# EAGLE design LEDS (EAGLE 6.5.0)
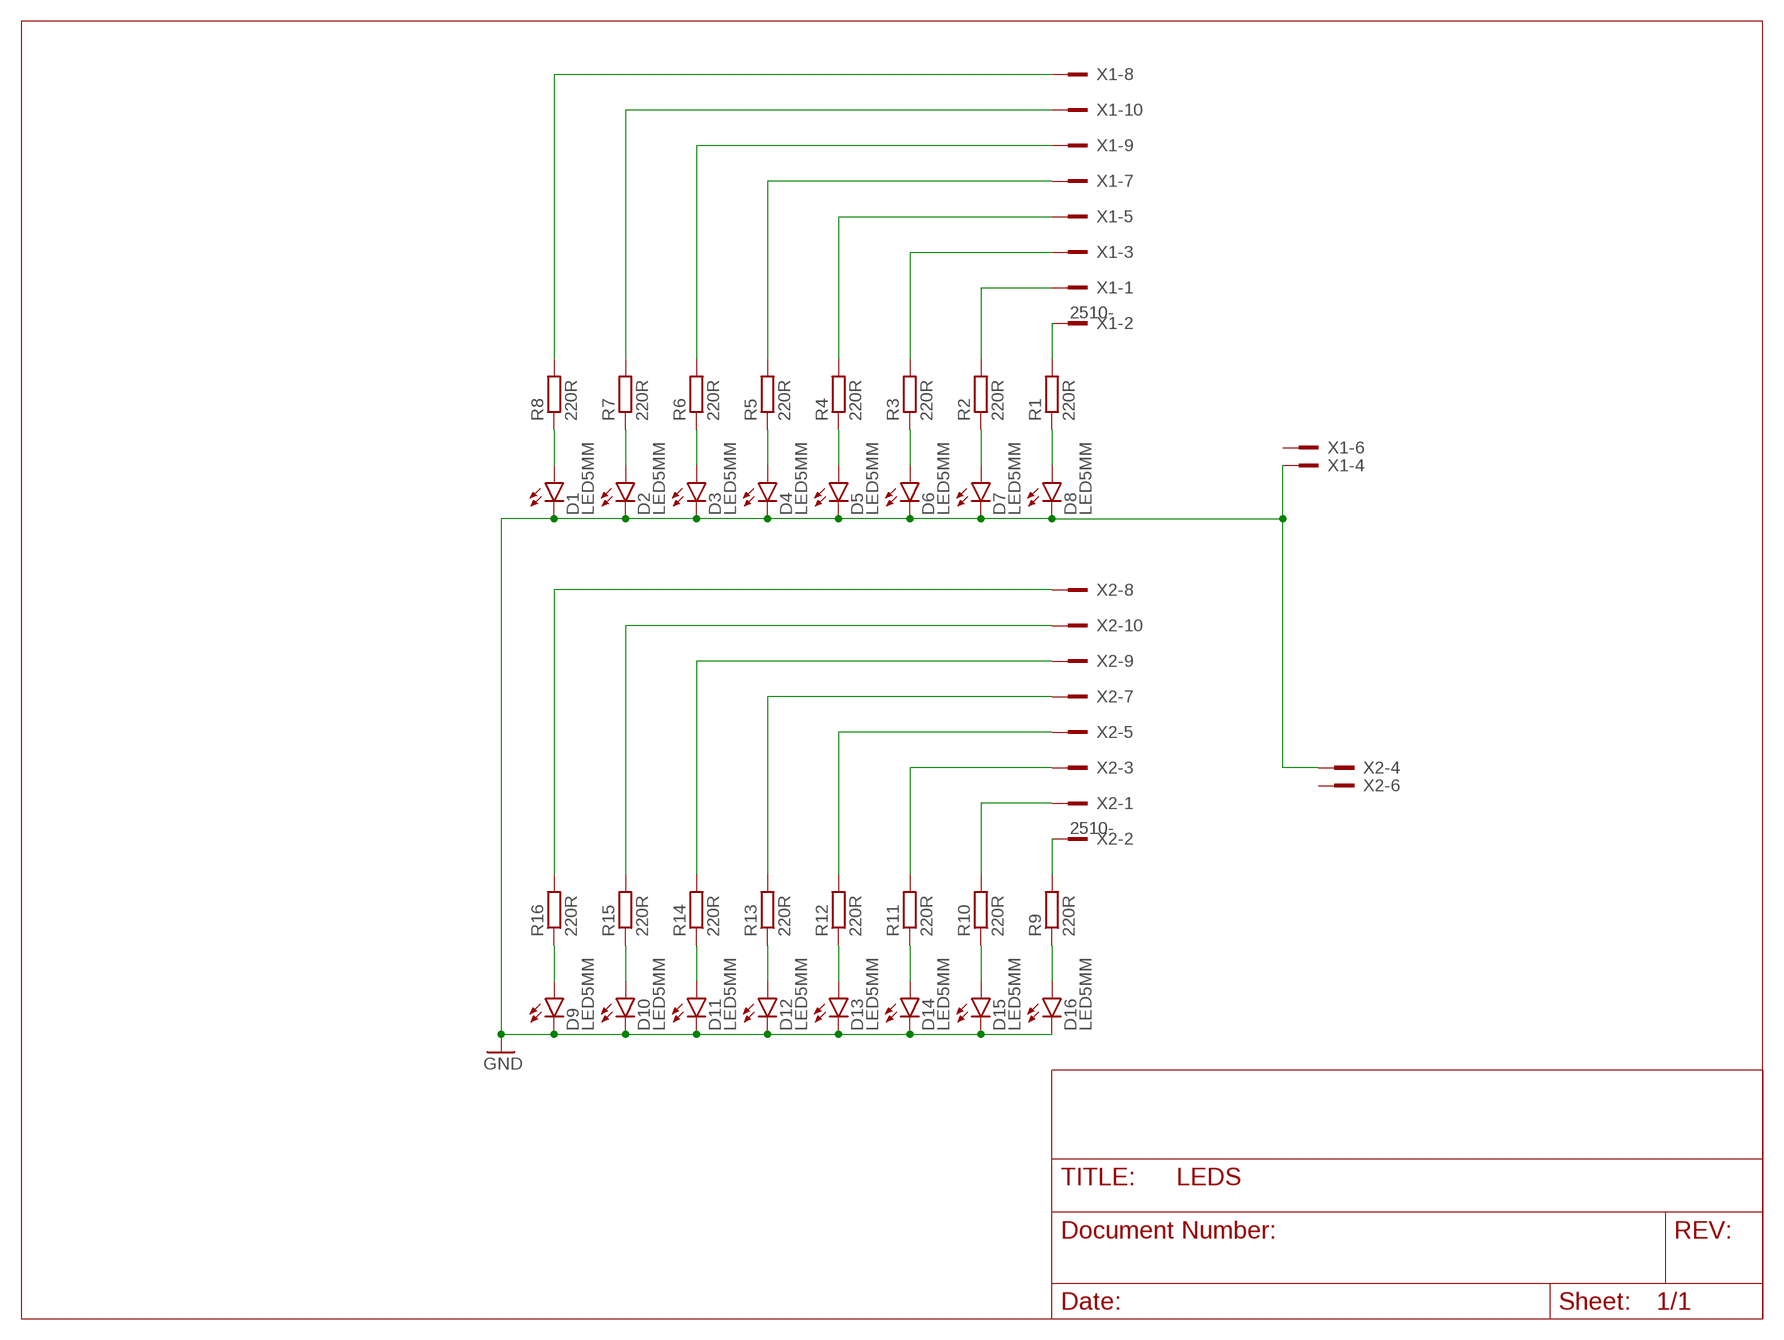
[diagram p0: schematic, sheet 1]

## Parts
D1  LED5MM  [LED5MM]
D2  LED5MM  [LED5MM]
D3  LED5MM  [LED5MM]
D4  LED5MM  [LED5MM]
D5  LED5MM  [LED5MM]
D6  LED5MM  [LED5MM]
D7  LED5MM  [LED5MM]
D8  LED5MM  [LED5MM]
D9  LED5MM  [LED5MM]
D10  LED5MM  [LED5MM]
D11  LED5MM  [LED5MM]
D12  LED5MM  [LED5MM]
D13  LED5MM  [LED5MM]
D14  LED5MM  [LED5MM]
D15  LED5MM  [LED5MM]
D16  LED5MM  [LED5MM]
R1  220R  R-EU_  [0204/ELVYS]
R2  220R  R-EU_  [0204/ELVYS]
R3  220R  R-EU_  [0204/ELVYS]
R4  220R  R-EU_  [0204/ELVYS]
R5  220R  R-EU_  [0204/ELVYS]
R6  220R  R-EU_  [0204/ELVYS]
R7  220R  R-EU_  [0204/ELVYS]
R8  220R  R-EU_  [0204/ELVYS]
R9  220R  R-EU_  [0204/ELVYS]
R10  220R  R-EU_  [0204/ELVYS]
R11  220R  R-EU_  [0204/ELVYS]
R12  220R  R-EU_  [0204/ELVYS]
R13  220R  R-EU_  [0204/ELVYS]
R14  220R  R-EU_  [0204/ELVYS]
R15  220R  R-EU_  [0204/ELVYS]
R16  220R  R-EU_  [0204/ELVYS]
X1  2510-  [PAK100/2500-10]
X2  2510-  [PAK100/2500-10]

## Nets
GND: D1.K(C) D2.K(C) D3.K(C) D4.K(C) D5.K(C) D6.K(C) D7.K(C) D8.K(C) D9.K(C) D10.K(C) D11.K(C) D12.K(C) D13.K(C) D14.K(C) D15.K(C) D16.K(C) X1.4 X2.4
N$1: R16.P$2 X2.8
N$2: R8.P$2 X1.8
N$3: R6.P$2 X1.9
N$4: R7.P$2 X1.10
N$5: R5.P$2 X1.7
N$6: R4.P$2 X1.5
N$7: R3.P$2 X1.3
N$8: R2.P$2 X1.1
N$9: R1.P$2 X1.2
N$10: R15.P$2 X2.10
N$11: R14.P$2 X2.9
N$12: R13.P$2 X2.7
N$13: R12.P$2 X2.5
N$14: R11.P$2 X2.3
N$15: R10.P$2 X2.1
N$16: R9.P$2 X2.2
N$17: D1.A R8.P$1
N$18: D2.A R7.P$1
N$19: D3.A R6.P$1
N$20: D4.A R5.P$1
N$21: D5.A R4.P$1
N$22: D6.A R3.P$1
N$23: D7.A R2.P$1
N$24: D8.A R1.P$1
N$26: D9.A R16.P$1
N$27: D10.A R15.P$1
N$28: D11.A R14.P$1
N$29: D12.A R13.P$1
N$30: D13.A R12.P$1
N$31: D14.A R11.P$1
N$32: D15.A R10.P$1
N$33: D16.A R9.P$1
Unconnected: X1.6 X2.6

## Library data of the parts
D1-D16 = gm-diodes:LED
R1-R16 = rcl:R-EU_: RESISTOR, European symbol
X1 X2 = con-3m:2510-: 3M (TM) Pak 100 4-Wall Header Source: 3M; MF: 3M; MPN: 2510-6002UB; OC_FARNELL: 9838244; OC_NEWARK: 46F4725

## Board
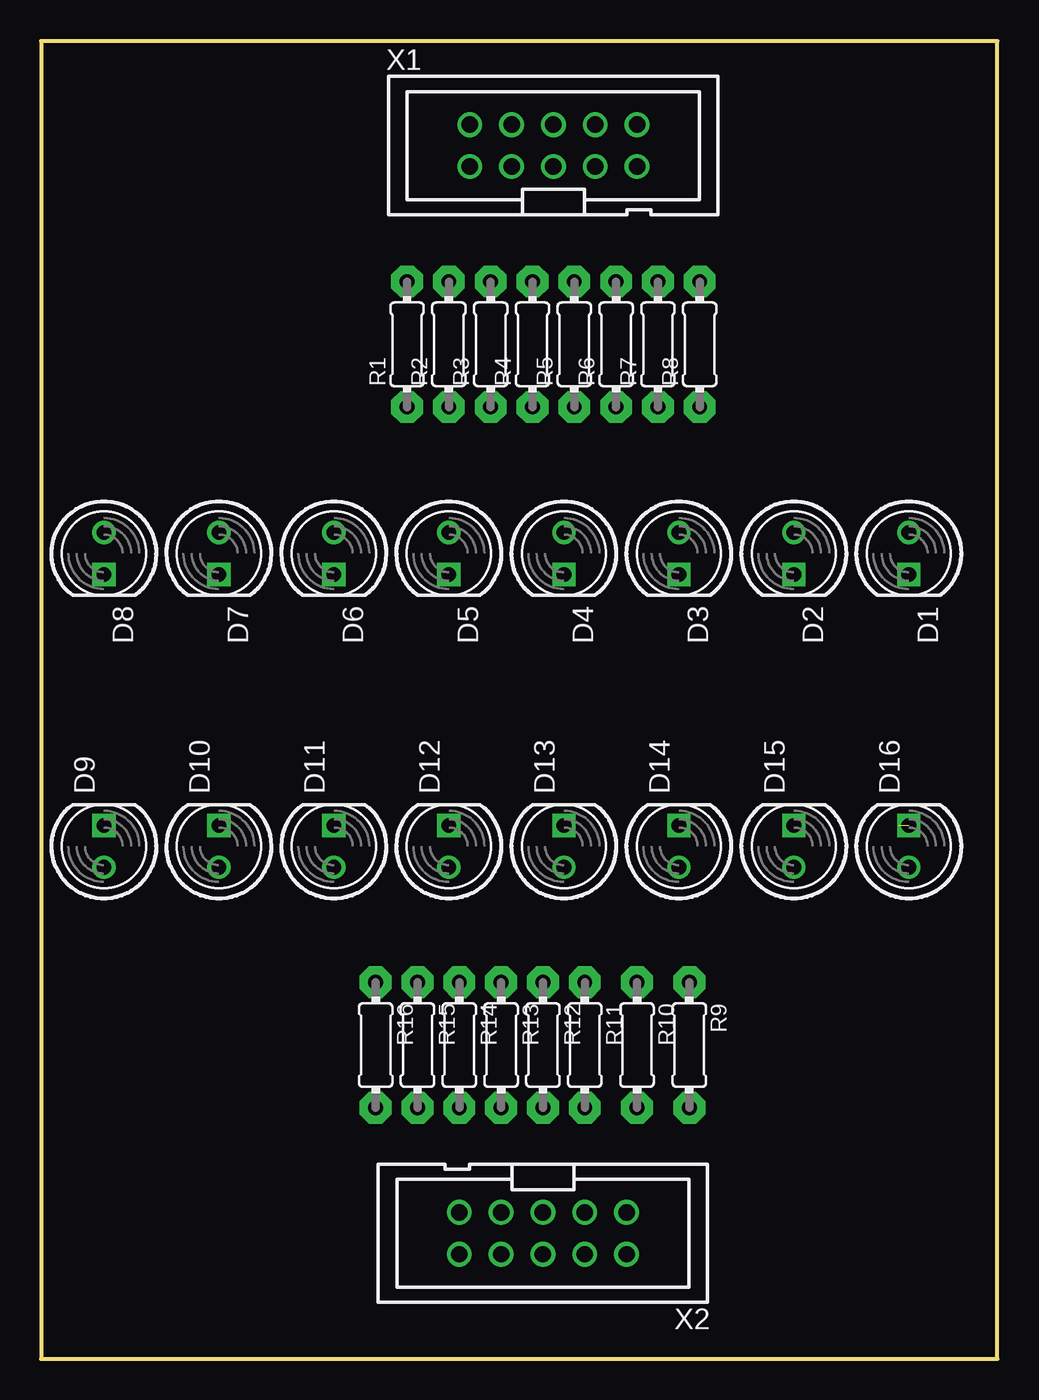
[diagram p1: board, top side]
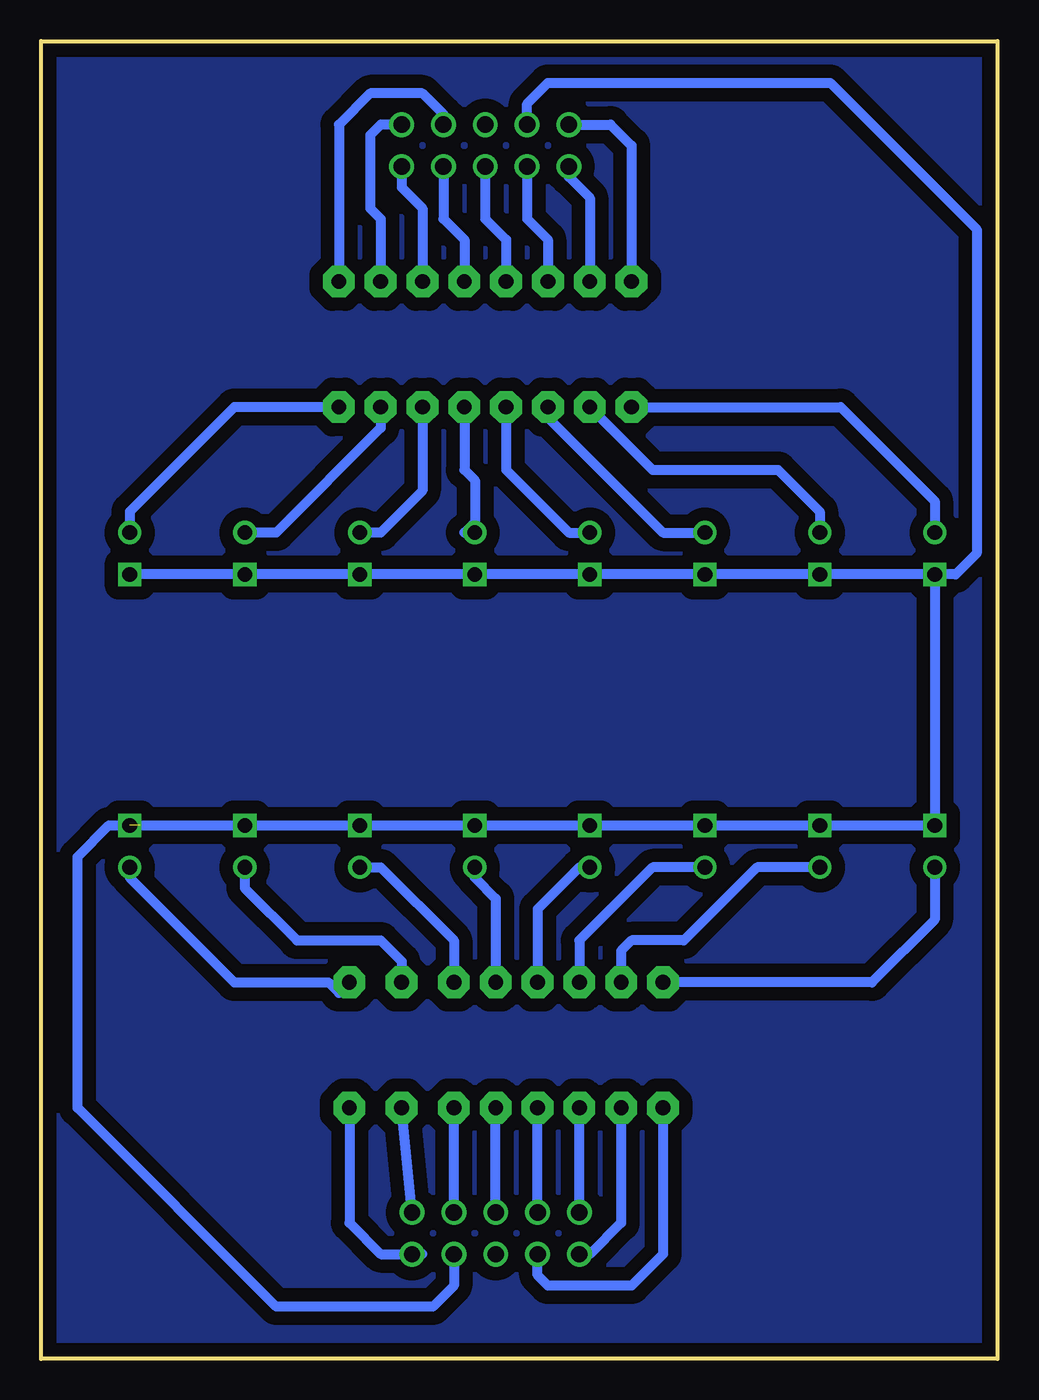
[diagram p2: board, bottom side, seen from below]

Size 58.09 x 80 mm. Coordinates in mm from the lower left corner, seen from the top.
Outline: 0,0 58.09,0 58.09,80 0,80 0,0
Copper layers (1*16): Top 0.035mm / dielectric 1.5mm / Bottom 0.035mm
Design rules "default *": minimum track width 10mil, minimum drill 24mil, track to track 12mil, track to pad 12mil, pad to pad 12mil, via to via 12mil, smd to smd 8mil, copper to edge 16mil, drill to drill 8mil, minimum pad ring 10mil, minimum via ring 8mil, stop-mask expansion 4mil, vias tented up to drill 0mil, thermal gap 10mil

### Footprints (pad centres in the part's own frame; a part is rotated, then mirrored left to right if it is on the bottom)
LED5MM = drill 0.9: A -1.27,0 | drill 0.9 square: K 1.27,0
0204/ELVYS = drill 0.9 pad 1.93 octagon: P$1 -6.35,0; P$2 1.27,0
PAK100/2500-10 = drill 1 pad 1.422: 1 -5.08,-1.27; 2 -5.08,1.27; 3 -2.54,-1.27; 4 -2.54,1.27; 5 0,-1.27; 6 0,1.27; 7 2.54,-1.27; 8 2.54,1.27; 9 5.08,-1.27; 10 5.08,1.27

### Placement (x,y rotation side)
D1  52.7,48.9 270 top
D2  45.72,48.9 270 top
D3  38.73,48.9 270 top
D4  31.75,48.9 270 top
D5  24.77,48.9 270 top
D6  17.78,48.9 270 top
D7  10.79,48.9 270 top
D8  3.81,48.9 270 top
D9  3.81,31.11 90 top
D10  10.79,31.11 90 top
D11  17.78,31.11 90 top
D12  24.77,31.11 90 top
D13  31.75,31.11 90 top
D14  38.73,31.11 90 top
D15  45.72,31.11 90 top
D16  52.7,31.11 90 top
R1  22.23,64.14 90 top
R2  24.77,64.14 90 top
R3  27.3,64.14 90 top
R4  29.84,64.14 90 top
R5  32.38,64.14 90 top
R6  34.92,64.14 90 top
R7  37.47,64.14 90 top
R8  40.01,64.14 90 top
R9  39.37,16.51 270 top
R10  36.2,16.51 270 top
R11  33.02,16.51 270 top
R12  30.48,16.51 270 top
R13  27.94,16.51 270 top
R14  25.4,16.51 270 top
R15  22.86,16.51 270 top
R16  20.32,16.51 270 top
X1  31.11,73.66 0 top
X2  30.48,7.62 180 top

### Tracks (layer width: path | path; a pad name or v marks a point on that pad's centre or on a via)
GND  (1 unrouted)
  Bottom 0.61: X1.4 28.57,76.2 27.3,77.47 10.16,77.47 1.27,68.58 1.27,48.9 2.54,47.62 D8.K | D8.K D7.K D6.K D5.K D4.K D3.K D2.K D1.K | D15.K 52.07,32.38 53.98,32.38 55.88,30.48 55.88,15.24 43.81,3.17 34.29,3.17 33.02,4.45 X2.4 | D15.K D14.K D13.K D12.K D11.K D10.K D9.K | D15.K D9.K | D8.K D9.K
N$1
  Bottom 0.61: R16.P$2 20.32,6.35 22.23,4.45 27.3,4.45 27.94,5.08 X2.8
N$2
  Bottom 0.61: X1.8 33.66,75.56 34.92,76.83 38.1,76.83 40.01,74.93 R8.P$2
N$3
  Bottom 0.61: X1.9 36.2,71.12 34.92,69.85 R6.P$2
N$4
  Bottom 0.61: X1.10 37.47,74.93 38.1,74.3 38.1,69.85 37.47,69.22 R7.P$2
N$5
  Bottom 0.61: X1.7 33.66,69.22 32.38,67.94 R5.P$2
N$6
  Bottom 0.61: X1.5 31.11,69.22 29.84,67.94 R4.P$2
N$7
  Bottom 0.61: X1.3 28.57,69.22 27.3,67.94 R3.P$2
N$8
  Bottom 0.61: X1.1 26.04,71.75 24.77,70.48 R2.P$2
N$9
  Bottom 0.61: X1.2 23.5,74.93 22.23,73.66 R1.P$2
N$10
  Bottom 0.61: R15.P$2 22.86,8.26 24.77,6.35 X2.10
N$11
  Bottom 0.61: X2.9 R14.P$2
N$12
  Bottom 0.61: X2.7 R13.P$2
N$13
  Bottom 0.61: X2.5 R12.P$2
N$14
  Bottom 0.61: X2.3 R11.P$2
N$15
  Bottom 0.61: X2.1 R10.P$2
N$16
  Bottom 0.61: 34.92,6.35 X2.2 37.47,6.35 39.37,8.26 R9.P$2
N$17
  Bottom 0.61: R8.P$1 46.35,57.78 52.7,51.44 D1.A
N$18
  Bottom 0.61: R7.P$1 37.47,56.52 43.81,50.16 D2.A
N$19
  Bottom 0.61: R6.P$1 34.92,52.7 37.47,50.16 D3.A
N$20
  Bottom 0.61: R5.P$1 32.38,53.98 31.75,53.34 31.75,50.8 32.38,50.16 D4.A
N$21
  Bottom 0.61: R4.P$1 29.84,53.98 26.04,50.16 D5.A
N$22
  Bottom 0.61: R3.P$1 27.3,57.15 20.32,50.16 D6.A
N$23
  Bottom 0.61: R2.P$1 20.95,53.98 13.34,53.98 10.79,51.44 D7.A
N$24
  Bottom 0.61: R1.P$1 9.53,57.78 3.81,52.07 D8.A
N$25
  pour Bottom (isolate 0.813): 0,80.01 57.78,80.01 57.78,0 0,0
N$26
  Bottom 0.61: D9.A 3.81,26.67 7.62,22.86 R16.P$1
N$27
  Bottom 0.61: D10.A 14.61,29.84 19.05,25.4 22.23,25.4 22.86,24.77 R15.P$1
N$28
  Bottom 0.61: D11.A 20.95,29.84 25.4,25.4 R14.P$1
N$29
  Bottom 0.61: D12.A 25.4,29.84 27.94,27.3 R13.P$1
N$30
  Bottom 0.61: D13.A 31.75,29.21 30.48,27.94 R12.P$1
N$31
  Bottom 0.61: D14.A 37.47,29.84 33.02,25.4 R11.P$1
N$32
  Bottom 0.61: D15.A 45.72,28.57 42.55,25.4 37.47,25.4 36.2,24.13 R10.P$1
N$33
  Bottom 0.61: D16.A 52.7,29.21 46.35,22.86 40.64,22.86 40.01,22.23 R9.P$1